# Altium schematic sheet M3406-Board_Match.SchDoc
size A4
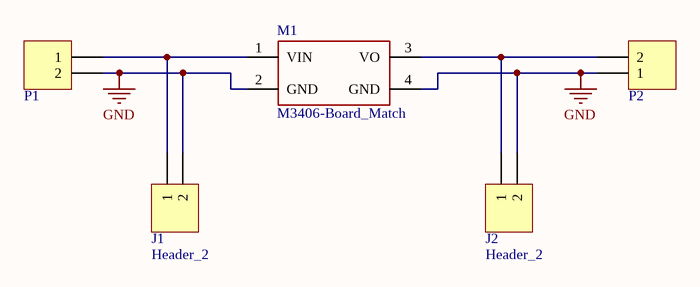
[diagram p0: M3406-Board_Match.SchDoc]

## Parts
J1  Header_2  [HDR-TH_2P-P2.54-V-M-1]
J2  Header_2  [HDR-TH_2P-P2.54-V-M-1]
M1  M3406-Board_Match  [M3406-Board_Match]
P1  KF301-5  [TH_P5.00_KF301-5.0-2P]  (value not drawn)
P2  KF301-5  [TH_P5.00_KF301-5.0-2P]  (value not drawn)

## Nets
GND: J1.2 J2.2 M1.2(GND) M1.4(GND) P1.2 P2.1
NetJ1_1: J1.1 M1.1(VIN) P1.1
NetJ2_1: J2.1 M1.3(VO) P2.2

## Library data of the parts
J1 J2 = Header_2: 直插,P=2.54mm; MPN: Header_2; Mounting Type: 直插
M1 = M3406-Board_Match: M3406匹配板; MPN: M3406-Board_Match
P1 P2 = KF301-5: 直插,P=2.54mm; MPN: KF301-5; Mounting Type: 直插